# EAGLE design eth_conn (EAGLE 7.2.0)
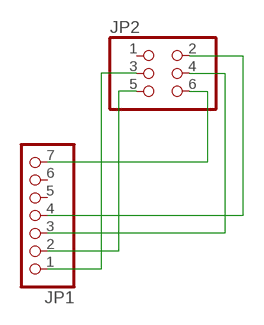
[diagram p0: schematic, sheet 1]

## Parts
JP1  PINHD-1X7  [1X07]
JP2  PINHD-2X3  [2X03]

## Nets
N$1: JP1.4 JP2.2
N$2: JP1.1 JP2.3
N$3: JP1.3 JP2.4
N$4: JP1.2 JP2.5
N$5: JP1.7 JP2.6
Unconnected: JP1.5 JP1.6 JP2.1

## Library data of the parts
JP1 = pinhead:PINHD-1X7: PIN HEADER
JP2 = pinhead:PINHD-2X3: PIN HEADER

## Board
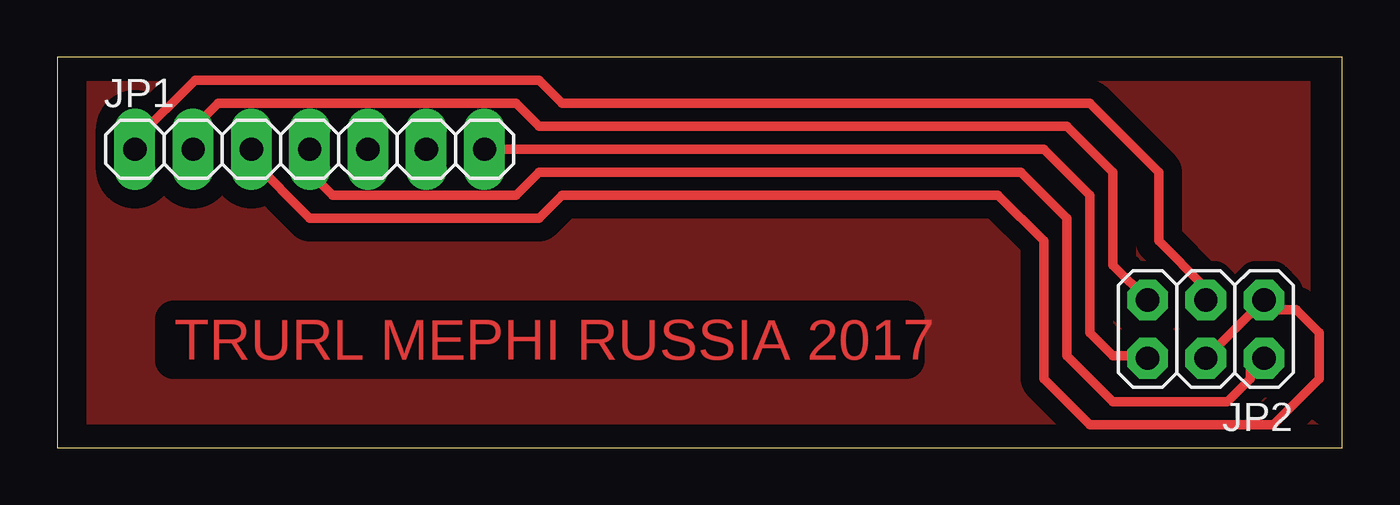
[diagram p1: board, top side]

Size 56 x 17 mm. Coordinates in mm from the lower left corner, seen from the top.
Outline: 0,0 56,0 56,17 0,17 0,0
Copper layers (1*16): Top 0.035mm / dielectric 1.5mm / Bottom 0.035mm
Design rules "default *": minimum track width 10mil, minimum drill 24mil, track to track 8mil, track to pad 8mil, pad to pad 8mil, via to via 8mil, smd to smd 8mil, copper to edge 40mil, drill to drill 8mil, minimum pad ring 15mil, minimum via ring 8mil, stop-mask expansion 4mil, vias tented up to drill 0mil, thermal gap 10mil

### Footprints (pad centres in the part's own frame; a part is rotated, then mirrored left to right if it is on the bottom)
1X07 = drill 1.016 long: 1 -7.62,0; 2 -5.08,0; 3 -2.54,0; 4 0,0; 5 2.54,0; 6 5.08,0; 7 7.62,0
2X03 = drill 1.016 octagon: 1 -2.54,-1.27; 2 -2.54,1.27; 3 0,-1.27; 4 0,1.27; 5 2.54,-1.27; 6 2.54,1.27

### Placement (x,y rotation side)
JP1  11,13 0 top
JP2  50.06,5.16 180 top

### Tracks (layer width: path | path; a pad name or v marks a point on that pad's centre or on a via)
N$1
  Top 0.406: JP1.4 11,12 12,11 20,11 21,12 42,12 44,10 44,4 46,2 51,2 52,3 52,3.49 JP2.2
N$2
  Top 0.406: JP1.1 3.38,13.38 6,16 21,16 22,15 45,15 48,12 48,9 50,7 50,6.49 JP2.3
N$3
  Top 0.406: JP1.3 8.46,12.54 11,10 21,10 22,11 41,11 43,9 43,3 45,1 53,1 55,3 55,5 54,6 52.17,6 JP2.4
N$4
  Top 0.406: JP1.2 5.92,13.92 7,15 20,15 21,14 44,14 46,12 46,7.95 JP2.5
N$5
  Top 0.406: JP1.7 43,13 45,11 45,5 46,4 47.41,4 JP2.6
N$6
  pour Top (isolate 0.813): 55,1 1.27,1 1.27,16.51 54.61,16.51 54.61,1.27

### Text on the board
Top: TRURL MEPHI RUSSIA 2017